# Altium project wius_hardware.PrjPcb
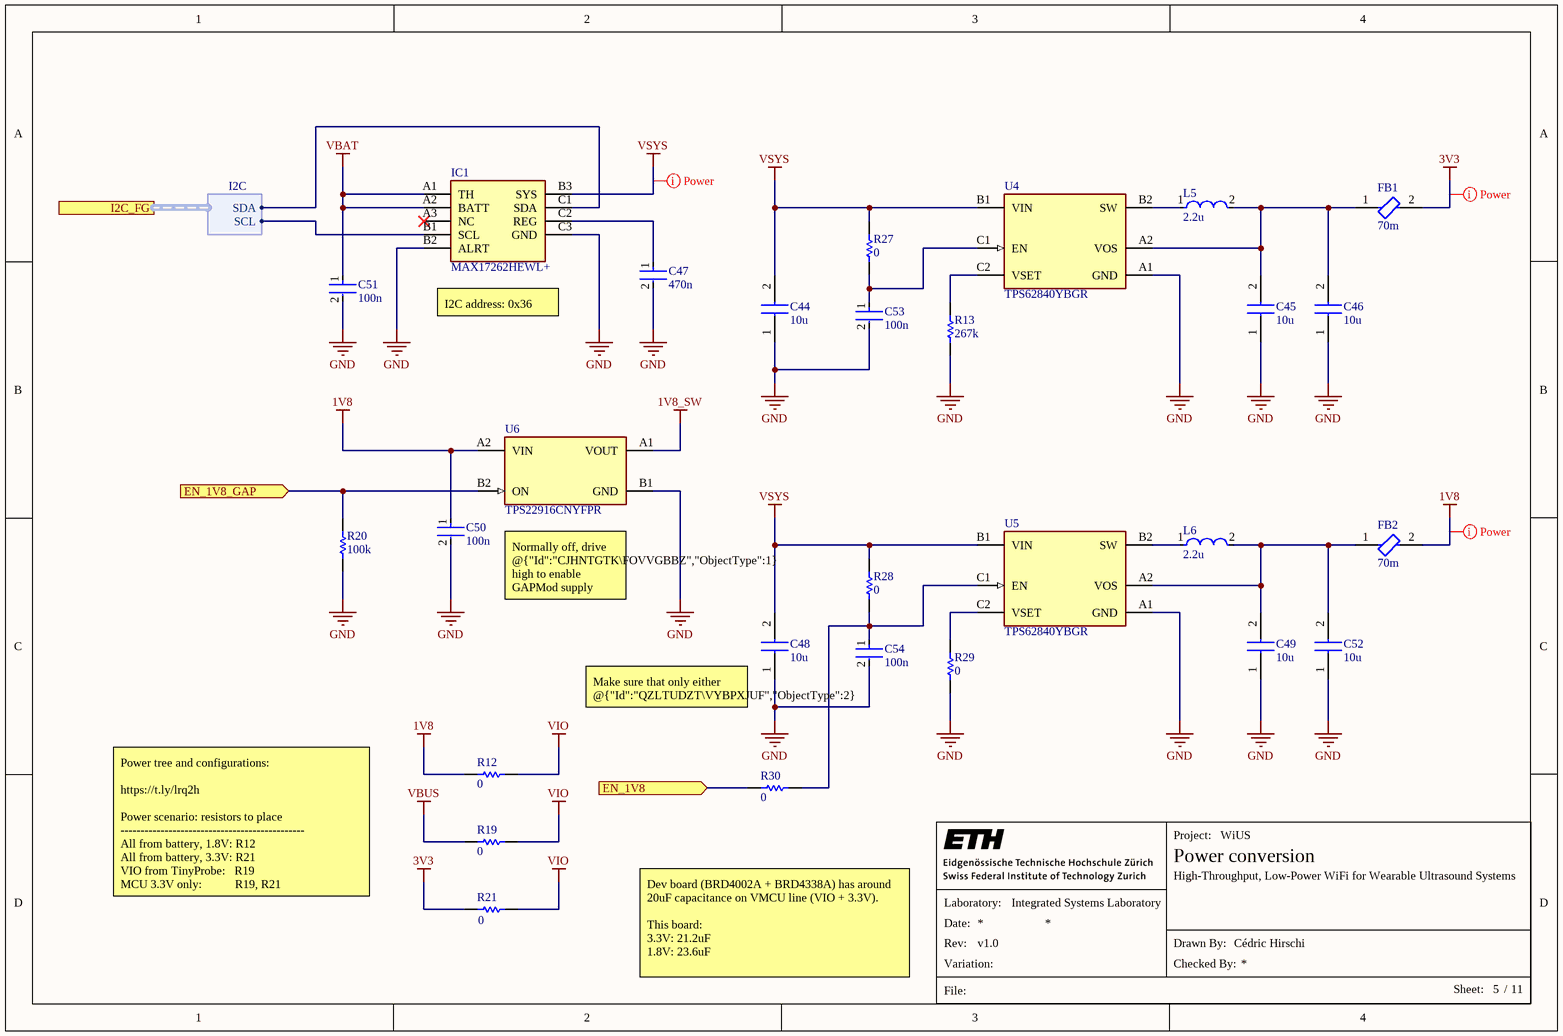
[diagram p0: power_conversion.SchDoc]
Desc1: High-Throughput, Low-Power WiFi for Wearable Ultrasound Systems; DrawnBy: Cédric Hirschi; FileInfo: =DocumentName; Organization: Integrated Systems Laboratory; ProjectTitle: WiUS; Revision: v1.0
5 sheets, 66 parts. Net scope: hierarchical (ports join the sheet entries above them; power ports are global).
Board file: wius.PcbDoc
Sheets:
  power_conversion.SchDoc
  power_io.SchDoc
    Core power conversion = power_core.SchDoc
    I/O bank B = io_b.SchDoc
  rf_clocks.SchDoc

## Sheet power_conversion.SchDoc: Power conversion
size A4; SheetNumber: 5; SheetTotal: 11

### Parts
C44  10u  [CAPC1608X100N]
C45  10u  [CAPC1608X100N]
C46  10u  [CAPC1608X100N]
C47  470n  [FP-GRM15-0_1-MFG]
C48  10u  [CAPC1608X100N]
C49  10u  [CAPC1608X100N]
C50  100n  [FP-GRT155-0_05-MFG]
C51  100n  [FP-GRT155-0_05-MFG]
C52  10u  [CAPC1608X100N]
C53  100n  [FP-GRT155-0_05-MFG]
C54  100n  [FP-GRT155-0_05-MFG]
FB1  70m  [FP-BLM15-0_05-MFG]
FB2  70m  [FP-BLM15-0_05-MFG]
IC1  MAX17262HEWL+  [BGA9C40P3X3_153X153X69]
L5  2.2u  [FP-DFE201612C-MFG]
L6  2.2u  [FP-DFE201612C-MFG]
R12  value 0  [RESC1005X40X25ML05T10]  (hidden comment: Resistor 0R 0402 63 mW)
R13  267k  [RESC1005X40X25LL05T10]
R19  value 0  [RESC1005X40X25ML05T10]  (hidden comment: Resistor 0R 0402 63 mW)
R20  100k  [RESC1005X40X25NL05T10]
R21  value 0  [RESC1005X40X25ML05T10]  (hidden comment: Resistor 0R 0402 63 mW)
R27  value 0  [RESC1005X40X25ML05T10]  (hidden comment: Resistor 0R 0402 63 mW)
R28  value 0  [RESC1005X40X25ML05T10]  (hidden comment: Resistor 0R 0402 63 mW)
R29  value 0  [RESC1005X40X25ML05T10]  (hidden comment: Resistor 0R 0402 63 mW)
R30  value 0  [RESC1005X40X25ML05T10]  (hidden comment: Resistor 0R 0402 63 mW)
U4  TPS62840YBGR  [FP-YBG0006-MFG]
U5  TPS62840YBGR  [FP-YBG0006-MFG]
U6  TPS22916CNYFPR  [FP-YFP0004-IPC_C]

### Ports
EN_1V8 (in, see main[4C], io_a[3B], power_io[6B]), EN_1V8_GAP (in, see main[4C], io_a[3B], power_io[6B]), I2C_FG (harness I2C, see main[4C], connectors[2B], io_b[4B], power_io[6C])

### Harnesses
I2C: SDA, SCL

### Nets
1V8: C50.1 FB2.2 R12.2 U6.A2(VIN)
1V8_SW: U6.A1(VOUT)
3V3: FB1.2 R21.1
GND: C44.1 C45.1 C46.1 C47.2 C48.1 C49.1 C50.2 C51.2 C52.1 C53.2 C54.2 IC1.B2(ALRT) IC1.C3(GND) R13.1 R20.1 R29.2 U4.A1(GND) U5.A1(GND) U6.B1(GND)
VBAT: C51.1 IC1.A1(TH) IC1.A2(BATT)
VBUS: R19.2
VIO: R12.1 R19.1 R21.2
VSYS: C44.2 C48.2 IC1.B3(SYS) R27.1 R28.1 U4.B1(VIN) U5.B1(VIN)
NetC45_2: C45.2 C46.2 FB1.1 L5.2 U4.A2(VOS)
NetC47_1: C47.1 IC1.C2(REG)
NetC49_2: C49.2 C52.2 FB2.1 L6.2 U5.A2(VOS)
NetC53_1: C53.1 R27.2 U4.C1(EN)
NetC54_1: C54.1 R28.2 R30.2 U5.C1(EN)
NetIC1_B1: IC1.B1(SCL) ; port I2C_FG.SCL
NetIC1_C1: IC1.C1(SDA) ; port I2C_FG.SDA
NetL5_1: L5.1 U4.B2(SW)
NetL6_1: L6.1 U5.B2(SW)
NetR13_2: R13.2 U4.C2(VSET)
NetR20_2: R20.2 U6.B2(ON) ; port EN_1V8_GAP
NetR29_1: R29.1 U5.C2(VSET)
NetR30_1: R30.1 ; port EN_1V8

Not connected (* = marked no-connect by the designer): IC1 A3(NC)*

### Layout directives
net class Power: 1V8, 3V3, VSYS

### Notes on the sheet
- (near IC1) I2C address: 0x36
- Normally off, drive @{"Id":"CJHNTGTK\FOVVGBBZ","ObjectType":1} high to enable GAPMod supply
- (near C48) Make sure that only either @{"Id":"QZLTUDZT\VYBPXJUF","ObjectType":2} or @{"Id":"QZLTUDZT\XKOCDFZE","ObjectType":2} is mounted
- Power tree and configurations:
  https://t.ly/lrq2h
  Power scenario: resistors to place
  ----------------------------------------------
  All from battery, 1.8V: R12
  All from battery, 3.3V: R21
  VIO from TinyProbe:   R19
  MCU 3.3V only:           R19, R21
- Dev board (BRD4002A + BRD4338A) has around 20uF capacitance on VMCU line (VIO + 3.3V).
  This board:
  3.3V: 21.2uF
  1.8V: 23.6uF
- Project:
- Laboratory:
- Date:
- File:
- Rev:
- Variation:
- Drawn By:
- Checked By:
- Sheet:
- /

### Library data of the parts
C44-C46 C48 C49 C52 = GMC10X7R106K10NT: Cap Cer 10UF 10V X7R 0603; Manufacturer_Name: Cal-Chip; Datasheet Link: https://88ce57.p3cdn1.secureserver.net/wp-content/uploads/2023/01/gmc_series-2.pdf; Height: 1mm; Manufacturer_Part_Number: GMC10X7R106K10NT; Supplier 1: Digikey; Supplier Part Number 1: 4713-GMC10X7R106K10NTCT-ND
C47 = CMP-2000-05009-2: CAP CER 0.47UF 10V X5R 0402; Manufacturer: Murata Electronics North America; Manufacturer Part Number: GRM155R61A474KE15D; Temperature Coefficient: 15%; Material: Ceramic; Tolerance: 10%; Device Class L3: Ceramic Capacitors; ComponentLink2Description: Datasheet; ComponentLink2URL: https://search.murata.co.jp/Ceramy/image/img/A01X/G101/ENG/GRM155R61A474KE15-01A.pdf; Package: GRM15-0.1; Voltage Rating: 10V; Capacitance: 0.47uF; Category: Cap; Temperature Range High: +85°C; Temperature Range Low: -55°C; Height: 0.55mm; Device Class L2: Capacitors; Lead Free: Yes; Mouser Description: Multilayer Ceramic Capacitors MLCC - SMD/SMT 0402 0.47uF 10volts X5R 10%; Ipc Land Pattern Name: CAPC10050X50; Temperature Characteristic: X5R; Digikey Description: CAP CER 0.47UF 10V X5R 0402; Value: 0.47uF; Octopart: https://octopart.com/grm155r61a474ke15d-murata-196883; Automotive: No; Device Class L1: Passive Components; Temperature: -55°C to +85°C; RoHS: TRUE
C50 C51 C53 C54 = CMP-06035-014200-1: Multi-Layer Ceramic Capacitor 100nF 50V X7R ±10% 0402 Paper T/R
FB1 FB2 = CMP-0686-00284-4: Chip Ferrite Bead, 0402, 80Ω @ 100MHz, 0.07Ω, 25%, 1.5A; Number of Lines: 1; DC Resistance-Max: 70mR; Impedance: 80R; Height: 0.5mm; Package Quantity: 1; RoHS Compliant: Yes; Max Operating Temperature: 125°C; Depth: 0.5mm; Max Current Rating: 1.5A; Max DC Current: 1.5A; Current Rating: 1.5A; Number of Pins: 2; Case Code (Imperial): 0402; Case/Package: 0402; Case Code (Metric): 1005; Material: Ferrite; Packaging: Tape and Reel; REACH SVHC: No SVHC; Length: 1mm; Tolerance: 25%; Termination: SMD/SMT; Series: BLM15PD; Number of Circuits: 1; Test Frequency: 100MHz; DC Resistance (DCR): 70mR; Min Operating Temperature: -55°C; Lead Free: Lead Free; Width: 0.5mm
IC1 = MAX17262HEWL+: Integrated Circuit; Manufacturer_Name: Analog Devices; Datasheet Link: https://www.analog.com/MAX17262/datasheet; Height: 0.69mm; Manufacturer_Part_Number: MAX17262HEWL+
L5 L6 = CMP-06042-009962-1: Shielded Wirewound Inductor 2.2uH 20% 1800mA 0.116Ω 0806 (2016)
R12 R19 R21 R27-R30 = CMP-009-00004-5: Chip Resistor, 0 Ohm, 0.063 W, -55 to 155 degC, 0402 (1005 Metric); Power: 63mW; Voltage Rating: 50V; Max Operating Temperature: 155°C; Pins: 2; RoHS Compliant: True; Min Operating Temperature: -55°C; Mounting Technology: SM; Case/Package: 0402
R13 = CMP-2002-07544-1: Manufacturer: Yageo; Part Number: RC0402FR-07267KL
R20 = CMP-2002-07343-1: Part Number: RC0402FR-07100KL; Manufacturer: Yageo / Phycomp
U4 U5 = CMP-04918-000401-1: ULTRA LOW IQ BUCK CONVERTER
U6 = CMP-04910-000105-1: IC PWR SWITCH P-CHAN 1:1 4DSBGA; Max Output Current: 2A; Number of Outputs: 1; Fault Protection: Reverse Current; Output Configuration: High Side; RoHS Compliant: Yes; Min Operating Temperature: -40°C; Packaging: Cut Tape; Number of Channels: 1; Max Operating Temperature: 85°C

## Sheet power_io.SchDoc: Power & I/O
size A3; SheetNumber: 6; SheetTotal: 11
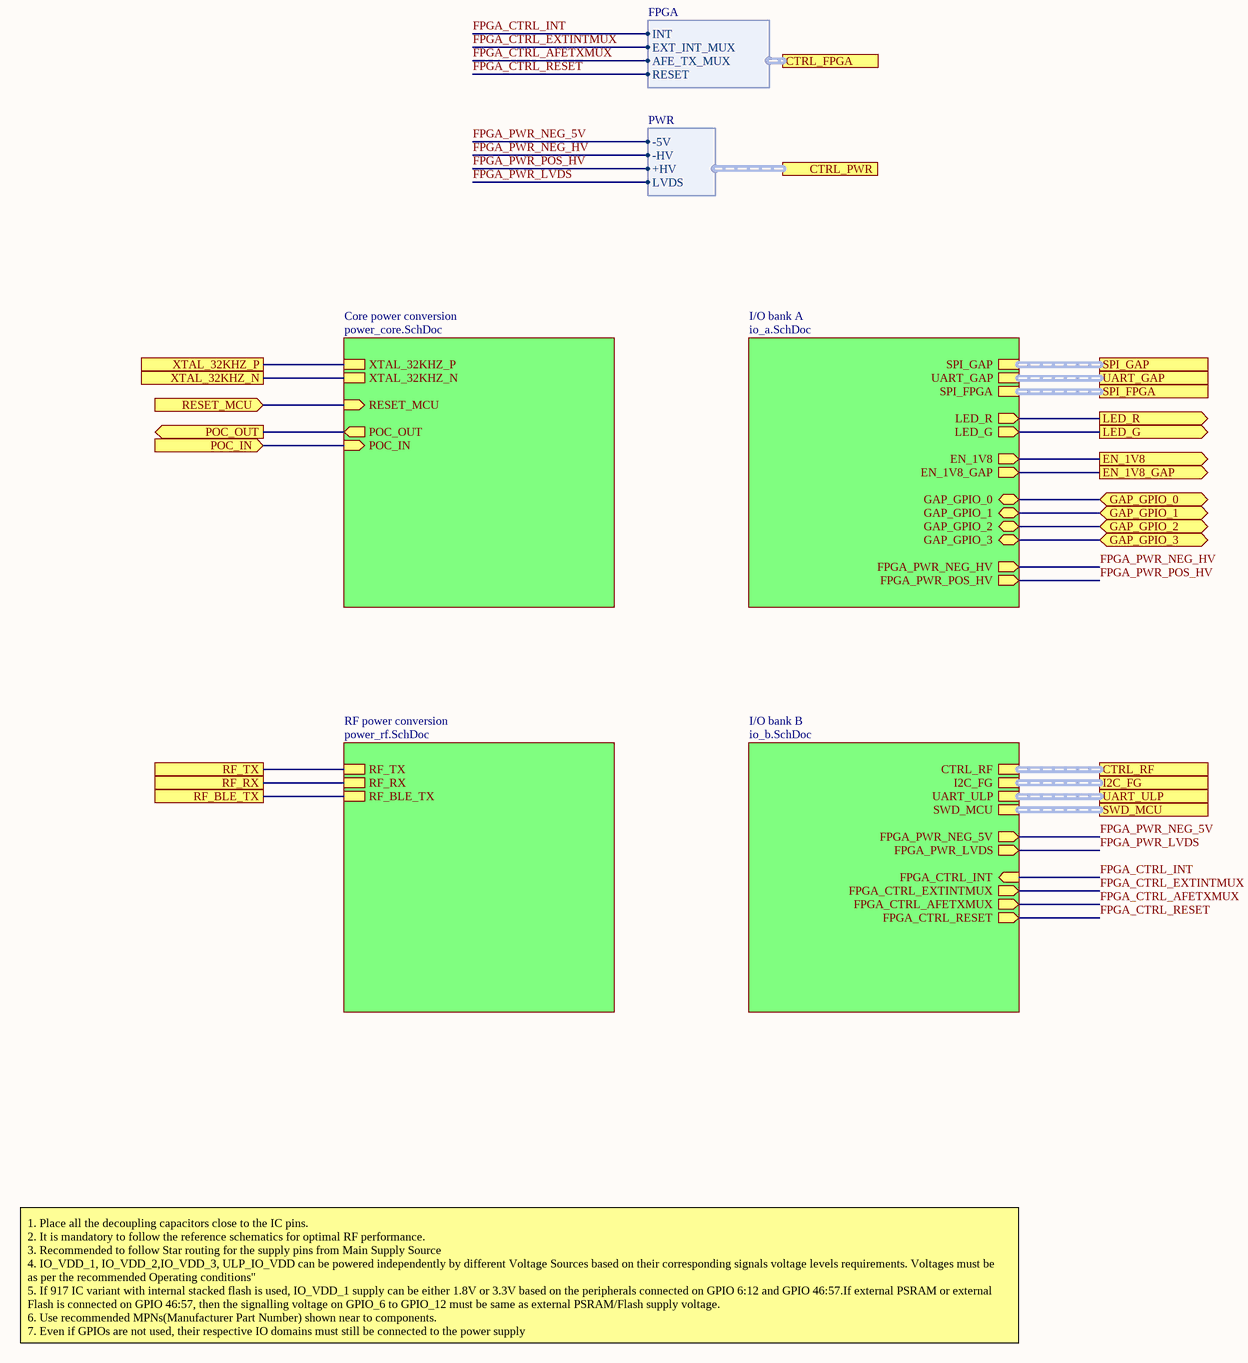
[diagram p1: power_io.SchDoc]

### Sub-sheets
Core power conversion = power_core.SchDoc: XTAL_32KHZ_P, XTAL_32KHZ_N, RESET_MCU (in), POC_OUT (out), POC_IN (in)
I/O bank A = io_a.SchDoc (file not in this document): SPI_GAP (harness SPI), UART_GAP (harness UART), SPI_FPGA (harness SPI), LED_R (out), LED_G (out), EN_1V8 (out), GAP_GPIO_0 (bidir), GAP_GPIO_1 (bidir), GAP_GPIO_2 (bidir), GAP_GPIO_3 (bidir), FPGA_PWR_NEG_HV (out), FPGA_PWR_POS_HV (out), EN_1V8_GAP (out)
I/O bank B = io_b.SchDoc: CTRL_RF (harness RF), I2C_FG (harness I2C), UART_ULP (harness UART), SWD_MCU (harness SWD), FPGA_CTRL_INT (in), FPGA_CTRL_EXTINTMUX (out), FPGA_CTRL_AFETXMUX (out), FPGA_CTRL_RESET (out), FPGA_PWR_NEG_5V (out), FPGA_PWR_LVDS (out)
RF power conversion = power_rf.SchDoc (file not in this document): RF_TX, RF_RX, RF_BLE_TX

### Ports
CTRL_FPGA (harness FPGA, see main[4B], connectors[4C]), CTRL_PWR (harness PWR, see main[4B], connectors[2C]), CTRL_RF (harness RF, see main[5A], io_b[4B], rf_clocks[1C]), EN_1V8 (out, see main[4C], io_a[3B], power_conversion[1B]), EN_1V8_GAP (out, see main[4C], io_a[3B]), GAP_GPIO_0 (bidir, see main[5B], gap[3C], io_a[3B]), GAP_GPIO_1 (bidir, see main[5B], gap[3C], io_a[3B]), GAP_GPIO_2 (bidir, see main[5B], gap[3C], io_a[3B]), GAP_GPIO_3 (bidir, see main[5B], gap[3C], io_a[3B]), I2C_FG (harness I2C, see main[4B], connectors[2B], io_b[4B], power_conversion[1A]), LED_G (out, see main[4B], debug_interface[1D], io_a[3A]), LED_R (out, see main[4A], debug_interface[1D], io_a[3A]), POC_IN (in, see main[4A], debug_interface[3B], power_core[1C]), POC_OUT (out, see main[4A], debug_interface[3A], power_core[1C]), RESET_MCU (in, see main[4A], debug_interface[1C], power_core[1C]), RF_BLE_TX (see main[5A], power_rf[4C], rf_clocks[4A]), RF_RX (see main[5A], power_rf[4B], rf_clocks[4B]), RF_TX (see main[5A], power_rf[4A], rf_clocks[4B]), SPI_FPGA (harness SPI, see main[4B], connectors[4B], io_a[3C]), SPI_GAP (harness SPI, see main[5B], gap[3C], io_a[3B]), SWD_MCU (harness SWD, see main[4A], debug_interface[3B], io_b[4C]), UART_GAP (harness UART, see main[5B], gap[1C], io_a[3B]), UART_ULP (harness UART, see main[4A], debug_interface[3B], io_b[4C]), XTAL_32KHZ_N (see main[5A], power_core[1C], rf_clocks[2B]), XTAL_32KHZ_P (see main[5A], power_core[1C], rf_clocks[1B])

### Harnesses
PWR: -5V, -HV, +HV, LVDS
FPGA: INT, EXT_INT_MUX, AFE_TX_MUX, RESET

### Nets
FPGA_CTRL_AFETXMUX: sheet I/O bank B/FPGA_CTRL_AFETXMUX, port CTRL_FPGA.AFE_TX_MUX
FPGA_CTRL_EXTINTMUX: sheet I/O bank B/FPGA_CTRL_EXTINTMUX, port CTRL_FPGA.EXT_INT_MUX
FPGA_CTRL_INT: sheet I/O bank B/FPGA_CTRL_INT, port CTRL_FPGA.INT
FPGA_CTRL_RESET: sheet I/O bank B/FPGA_CTRL_RESET, port CTRL_FPGA.RESET
FPGA_PWR_LVDS: sheet I/O bank B/FPGA_PWR_LVDS, port CTRL_PWR.LVDS
FPGA_PWR_NEG_5V: sheet I/O bank B/FPGA_PWR_NEG_5V, port CTRL_PWR.-5V
FPGA_PWR_NEG_HV: sheet I/O bank A/FPGA_PWR_NEG_HV, port CTRL_PWR.-HV
FPGA_PWR_POS_HV: sheet I/O bank A/FPGA_PWR_POS_HV, port CTRL_PWR.+HV
POC_IN: port POC_IN, sheet Core power conversion/POC_IN
POC_OUT: port POC_OUT, sheet Core power conversion/POC_OUT
RESET_MCU: port RESET_MCU, sheet Core power conversion/RESET_MCU
NetU2_A29: port XTAL_32KHZ_P, sheet Core power conversion/XTAL_32KHZ_P
NetU2_B26: port XTAL_32KHZ_N, sheet Core power conversion/XTAL_32KHZ_N
(unnamed): port RF_TX, sheet RF power conversion/RF_TX
(unnamed): port RF_RX, sheet RF power conversion/RF_RX
(unnamed): port RF_BLE_TX, sheet RF power conversion/RF_BLE_TX
(unnamed): port LED_R, sheet I/O bank A/LED_R
(unnamed): port LED_G, sheet I/O bank A/LED_G
(unnamed): port EN_1V8, sheet I/O bank A/EN_1V8
(unnamed): port GAP_GPIO_0, sheet I/O bank A/GAP_GPIO_0
(unnamed): port GAP_GPIO_1, sheet I/O bank A/GAP_GPIO_1
(unnamed): port GAP_GPIO_2, sheet I/O bank A/GAP_GPIO_2
(unnamed): port GAP_GPIO_3, sheet I/O bank A/GAP_GPIO_3
(unnamed): port EN_1V8_GAP, sheet I/O bank A/EN_1V8_GAP

### Buses and harness runs
harness port CTRL_RF = sheet I/O bank B/CTRL_RF
harness port I2C_FG = sheet I/O bank B/I2C_FG
harness port SPI_FPGA = sheet I/O bank A/SPI_FPGA
harness port SPI_GAP = sheet I/O bank A/SPI_GAP
harness port SWD_MCU = sheet I/O bank B/SWD_MCU
harness port UART_GAP = sheet I/O bank A/UART_GAP
harness port UART_ULP = sheet I/O bank B/UART_ULP

### Notes on the sheet
- 1. Place all the decoupling capacitors close to the IC pins.
  2. It is mandatory to follow the reference schematics for optimal RF performance.
  3. Recommended to follow Star routing for the supply pins from Main Supply Source
  4. IO_VDD_1, IO_VDD_2,IO_VDD_3, ULP_IO_VDD can be powered independently by different Voltage Sources based on their corresponding signals voltage levels requirements. Voltages must be
  as per the recommended Operating conditions"
  5. If 917 IC variant with internal stacked flash is used, IO_VDD_1 supply can be either 1.8V or 3.3V based on the peripherals connected on GPIO 6:12 and GPIO 46:57.If external PSRAM or external
  Flash is connected on GPIO 46:57, then the signalling voltage on GPIO_6 to GPIO_12 must be same as external PSRAM/Flash supply voltage.
  6. Use recommended MPNs(Manufacturer Part Number) shown near to components.
  7. Even if GPIOs are not used, their respective IO domains must still be connected to the power supply
- Project:
- Laboratory:
- Date:
- File:
- Rev:
- Variation:
- Drawn By:
- Checked By:
- Sheet:
- /

## Sheet power_core.SchDoc: Core power conversion
size A4; SheetNumber: 7; SheetTotal: 11
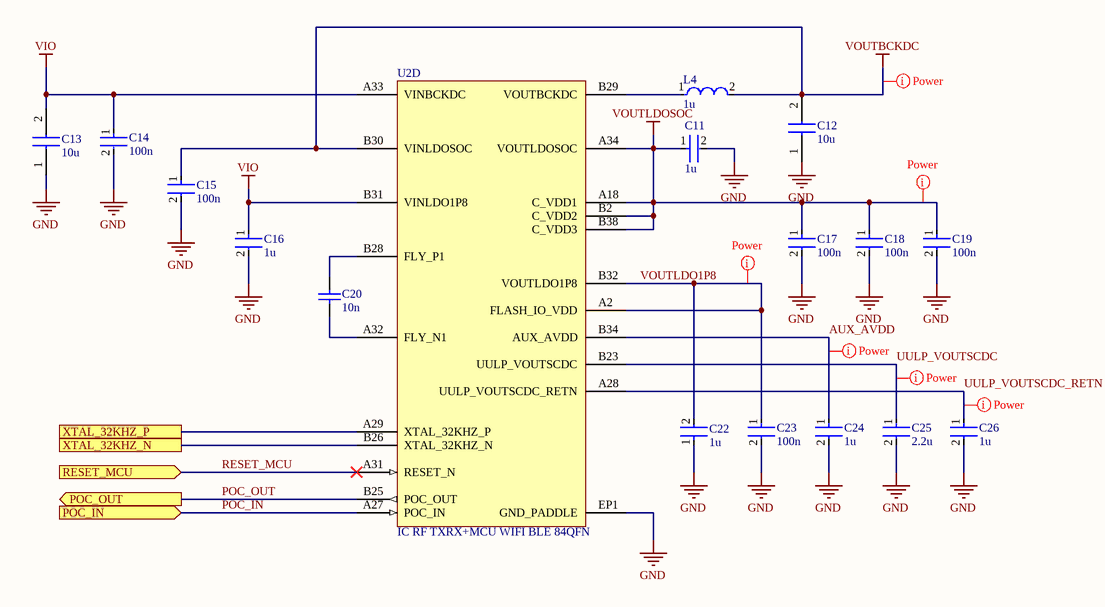
[diagram p2: power_core.SchDoc]

### Parts
C11  1u  [FP-GRM155-0_05-MFG]
C12  10u  [CAPC1608X100N]
C13  10u  [CAPC1608X100N]
C14  100n  [FP-GRT155-0_05-MFG]
C15  100n  [FP-GRT155-0_05-MFG]
C16  1u  [FP-GRM155-0_05-MFG]
C17  100n  [FP-GRT155-0_05-MFG]
C18  100n  [FP-GRT155-0_05-MFG]
C19  100n  [FP-GRT155-0_05-MFG]
C20  10n  [CAPC1005X55X25LL05T10]
C22  1u  [FP-GRM155-0_05-MFG]
C23  100n  [FP-GRT155-0_05-MFG]
C24  1u  [FP-GRM155-0_05-MFG]
C25  2.2u  [FP-GRM155-0_2-IPC_C]
C26  1u  [FP-GRM155-0_05-MFG]
L4  1u  [FP-DFE201210U-IPC_C]
U2  IC RF TXRX+MCU WIFI BLE 84QFN  [SIWG917M110LGTBA]  (part D of 4)

### Ports
POC_IN (in, see power_io[3B], debug_interface[3B], power_io[2B]), POC_OUT (out, see power_io[3B], debug_interface[3A], power_io[2B]), RESET_MCU (in, see power_io[3B], debug_interface[1C], power_io[2B]), XTAL_32KHZ_N (see power_io[3B], power_io[2B], rf_clocks[2B]), XTAL_32KHZ_P (see power_io[3B], power_io[2B], rf_clocks[1B])

### Nets
GND: C11.2 C12.1 C13.1 C14.2 C15.2 C16.2 C17.2 C18.2 C19.2 C22.1 C23.2 C24.2 C25.2 C26.2 U2.EP1(GND_PADDLE)
VIO: C13.2 C14.1 C16.1 U2.A33(VINBCKDC) U2.B31(VINLDO1P8)
VOUTBCKDC: C12.2 C15.1 L4.2 U2.B30(VINLDOSOC)
VOUTLDOSOC: C11.1 C17.1 C18.1 C19.1 U2.A18(C_VDD1) U2.A34(VOUTLDOSOC) U2.B2(C_VDD2) U2.B38(C_VDD3)
AUX_AVDD: C24.1 U2.B34(AUX_AVDD)
POC_IN: U2.A27(POC_IN) ; port POC_IN
POC_OUT: U2.B25(POC_OUT) ; port POC_OUT
RESET_MCU: U2.A31(RESET_N) ; port RESET_MCU
UULP_VOUTSCDC: C25.1 U2.B23(UULP_VOUTSCDC)
UULP_VOUTSCDC_RETN: C26.1 U2.A28(UULP_VOUTSCDC_RETN)
VOUTLDO1P8: C22.2 C23.1 U2.A2(FLASH_IO_VDD) U2.B32(VOUTLDO1P8)
NetC20_1: C20.1 U2.B28(FLY_P1)
NetC20_2: C20.2 U2.A32(FLY_N1)
NetL4_1: L4.1 U2.B29(VOUTBCKDC)
NetU2_A29: U2.A29(XTAL_32KHZ_P) ; port XTAL_32KHZ_P
NetU2_B26: U2.B26(XTAL_32KHZ_N) ; port XTAL_32KHZ_N

### Layout directives
net class Power: AUX_AVDD, UULP_VOUTSCDC, UULP_VOUTSCDC_RETN, VOUTBCKDC, VOUTLDO1P8, VOUTLDOSOC

### Notes on the sheet
- Project:
- Laboratory:
- Date:
- File:
- Rev:
- Variation:
- Drawn By:
- Checked By:
- Sheet:
- /

### Library data of the parts
C11 C16 C22 C24 C26 = CMP-06035-025126-1: Chip Multilayer Ceramic Capacitors for General Purpose, 0402, 1.0uF, X6S, 22%, 10%, 16V; Capacitance: 1uF; Thickness: 500um; Voltage Rating (DC): 16V; Tolerance: 10%; Width: 500um; Length: 1mm; Dielectric: X6S
C12 C13 = GMC10X7R106K10NT: as C44 on sheet power_conversion; Datasheet Link: https://88ce57.p3cdn1.secureserver.net/wp-content/uploads/2023/01/gmc_series-2.pdf; Height: 1mm; Manufacturer_Part_Number: GMC10X7R106K10NT; Supplier 1: Digikey; Supplier Part Number 1: 4713-GMC10X7R106K10NTCT-ND
C14 C15 C17-C19 C23 = CMP-06035-014200-1: as C50 on sheet power_conversion
C20 = CMP-1034-01880-2: Manufacturer: Murata; Part Number: GRM155R71E103KA01D
C25 = CMP-06035-000377-1: Chip Multilayer Ceramic Capacitors for General Purpose, 0402, 2.2uF, X7S, 22%, 10%, 10V; Thickness: 0.022inch; Height: 0.5mm; Packaging: Tape and Reel; Voltage Rating (DC): 10V; Tolerance: 10%; Capacitance: 2.2uF; Case Code (Metric): 1005; Voltage Rating: 10V; Termination: SMD/SMT; Weight: 0.000212oz; Min Operating Temperature: -55°C; Max Operating Temperature: 125°C; Case/Package: 0402; Length: 0.039inch; Dielectric: X7S; Resistor Type: Ceramic; Width: 0.5mm; Mount: Surface Mount; Package Quantity: 10000; Case Code (Imperial): 0402; Lead Free: Lead Free
L4 = CMP-06042-016601-1: FIXED IND 1.0UH 2.0A 95MOHM; RoHS Compliant: Yes
U2 = SIWG917

## Sheet io_b.SchDoc: I/O bank B
size A4; SheetNumber: 10; SheetTotal: 11
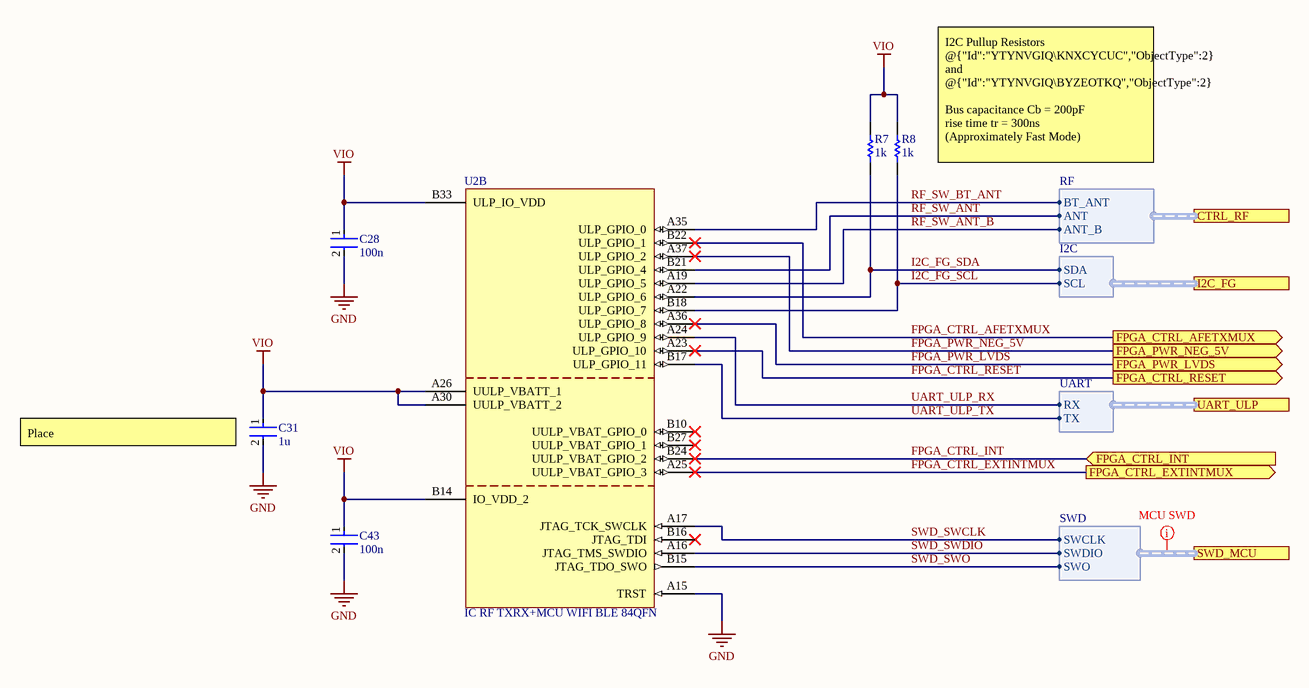
[diagram p3: io_b.SchDoc]

### Parts
C28  100n  [FP-GRT155-0_05-MFG]
C31  1u  [FP-GRM155-0_05-MFG]
C43  100n  [FP-GRT155-0_05-MFG]
R7  1k  [RESC1005X40X25LL05T10]
R8  1k  [RESC1005X40X25LL05T10]
U2  IC RF TXRX+MCU WIFI BLE 84QFN  [SIWG917M110LGTBA]  (part B of 4)

### Ports
CTRL_RF (harness RF, see power_io[6C], rf_clocks[1C]), FPGA_CTRL_AFETXMUX (out, see power_io[6C]), FPGA_CTRL_EXTINTMUX (out, see power_io[6C]), FPGA_CTRL_INT (in, see power_io[6C]), FPGA_CTRL_RESET (out, see power_io[6C]), FPGA_PWR_LVDS (out, see power_io[6C]), FPGA_PWR_NEG_5V (out, see power_io[6C]), I2C_FG (harness I2C, see power_io[6C], connectors[2B], power_conversion[1A], power_io[6C]), SWD_MCU (harness SWD, see power_io[6C], debug_interface[3B], power_io[6C]), UART_ULP (harness UART, see power_io[6C], debug_interface[3B], power_io[6C])

### Harnesses
I2C: SDA, SCL
RF: BT_ANT, ANT, ANT_B
UART: RX, TX
SWD: SWCLK, SWDIO, SWO

### Nets
GND: C28.2 C31.2 C43.2 U2.A15(TRST)
VIO: C28.1 C31.1 C43.1 R7.2 R8.2 U2.A26(UULP_VBATT_1) U2.A30(UULP_VBATT_2) U2.B14(IO_VDD_2) U2.B33(ULP_IO_VDD)
FPGA_CTRL_AFETXMUX: U2.B22(ULP_GPIO_1) ; port FPGA_CTRL_AFETXMUX
FPGA_CTRL_EXTINTMUX: U2.A25(UULP_VBAT_GPIO_3) ; port FPGA_CTRL_EXTINTMUX
FPGA_CTRL_INT: U2.B24(UULP_VBAT_GPIO_2) ; port FPGA_CTRL_INT
FPGA_CTRL_RESET: U2.A23(ULP_GPIO_10) ; port FPGA_CTRL_RESET
FPGA_PWR_LVDS: U2.A36(ULP_GPIO_8) ; port FPGA_PWR_LVDS
FPGA_PWR_NEG_5V: U2.A37(ULP_GPIO_2) ; port FPGA_PWR_NEG_5V
I2C_FG_SCL: R8.1 U2.B18(ULP_GPIO_7) ; port I2C_FG.SCL
I2C_FG_SDA: R7.1 U2.A22(ULP_GPIO_6) ; port I2C_FG.SDA
RF_SW_ANT: U2.B21(ULP_GPIO_4) ; port CTRL_RF.ANT
RF_SW_ANT_B: U2.A19(ULP_GPIO_5) ; port CTRL_RF.ANT_B
RF_SW_BT_ANT: U2.A35(ULP_GPIO_0) ; port CTRL_RF.BT_ANT
SWD_SWCLK: U2.A17(JTAG_TCK_SWCLK) ; port SWD_MCU.SWCLK
SWD_SWDIO: U2.A16(JTAG_TMS_SWDIO) ; port SWD_MCU.SWDIO
SWD_SWO: U2.B15(JTAG_TDO_SWO) ; port SWD_MCU.SWO
UART_ULP_RX: U2.A24(ULP_GPIO_9) ; port UART_ULP.RX
UART_ULP_TX: U2.B17(ULP_GPIO_11) ; port UART_ULP.TX

Not connected (* = marked no-connect by the designer): U2 B10(UULP_VBAT_GPIO_0)* B16(JTAG_TDI)* B27(UULP_VBAT_GPIO_1)*

### Layout directives
net class SWD_MCU: (no net found under the mark)

### Notes on the sheet
- (near R8) I2C Pullup Resistors @{"Id":"YTYNVGIQ\KNXCYCUC","ObjectType":2} and @{"Id":"YTYNVGIQ\BYZEOTKQ","ObjectType":2}
  Bus capacitance Cb = 200pF
  rise time tr = 300ns
  (Approximately Fast Mode)
  Pullup resistance Rp
  min = 720Ohm
  max = 1770Ohm
- (near C31) Place @{"Id":"YTYNVGIQ\TQWKBKJS","ObjectType":2} close to UULP_VBATT_2
- Project:
- Laboratory:
- Date:
- File:
- Rev:
- Variation:
- Drawn By:
- Checked By:
- Sheet:
- /

### Library data of the parts
C28 C43 = CMP-06035-014200-1: as C50 on sheet power_conversion
C31 = CMP-06035-025126-1: as C11 on sheet power_core; Thickness: 500um; Voltage Rating (DC): 16V; Tolerance: 10%; Width: 500um; Length: 1mm; Dielectric: X6S
R7 R8 = CMP-2002-07865-1: Manufacturer: Yageo; Part Number: RC0402FR-131KL
U2 = SIWG917

## Sheet rf_clocks.SchDoc: RF & clocks
size A4; SheetNumber: 11; SheetTotal: 11
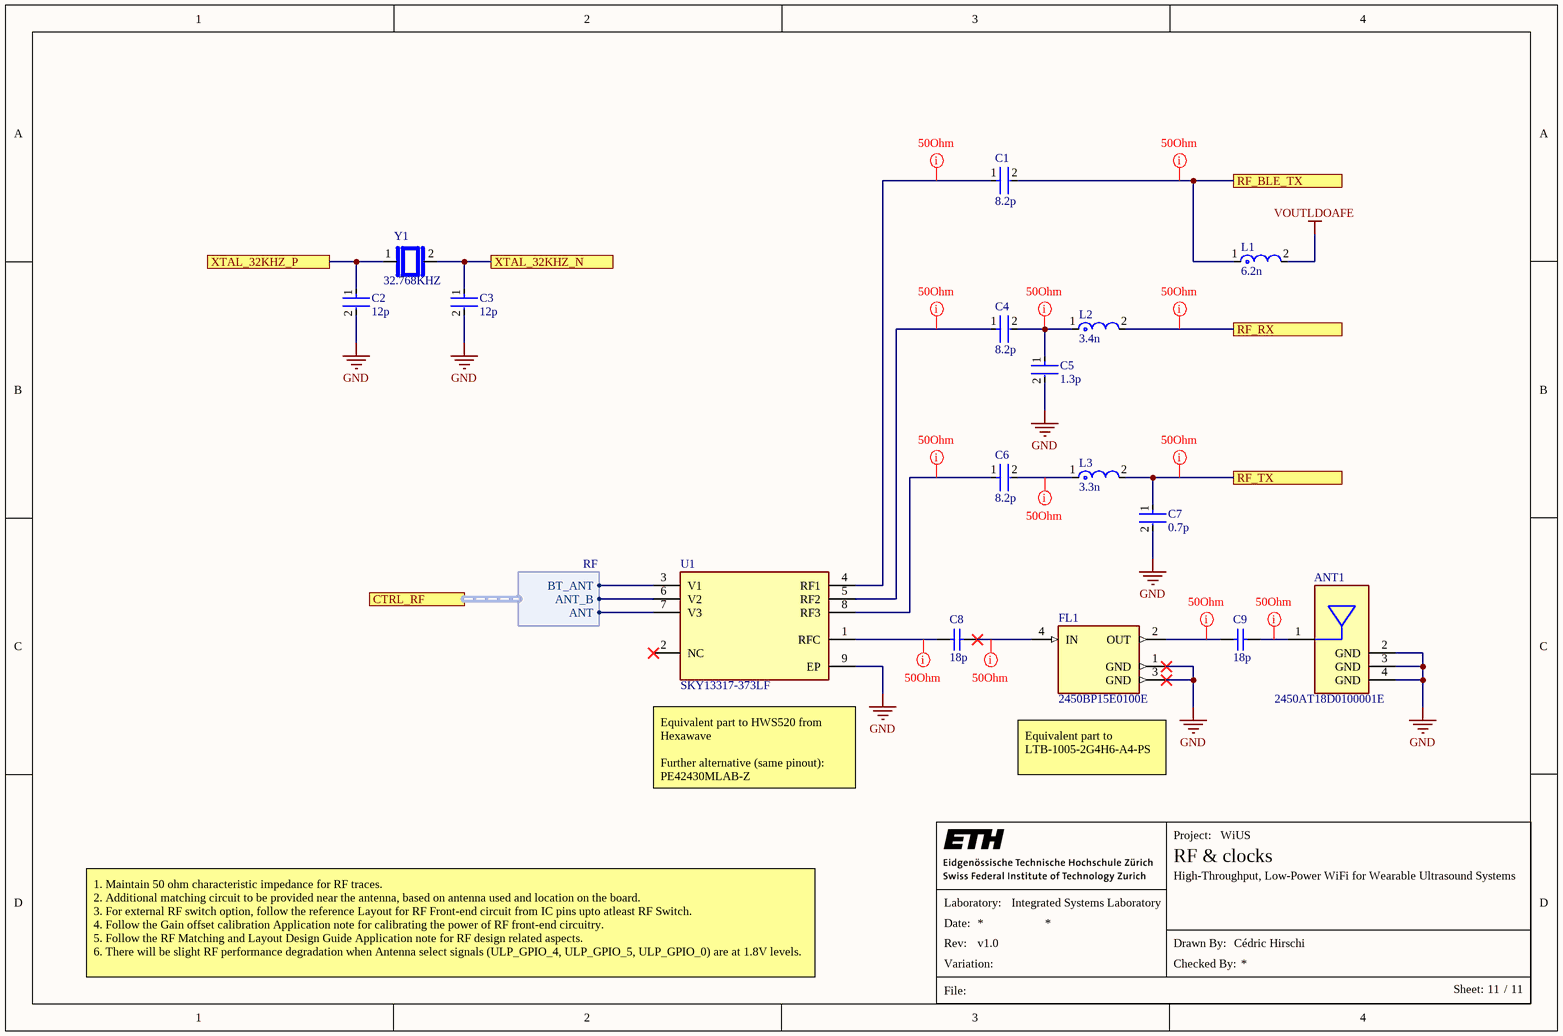
[diagram p4: rf_clocks.SchDoc]

### Parts
ANT1  2450AT18D0100001E  [FP-2450AT18D0100001E-MFG]
C1  8.2p  [FP-GJM155-0_05-IPC_B]
C2  12p  [FP-GRM155-0_05-MFG]
C3  12p  [FP-GRM155-0_05-MFG]
C4  8.2p  [FP-GJM155-0_05-IPC_B]
C5  1.3p  [FP-GJM155-0_05-IPC_B]
C6  8.2p  [FP-GJM155-0_05-IPC_B]
C7  0.7p  [FP-GJM155-0_05-IPC_C]
C8  18p  [CAPC1005X55X25LL05T10]
C9  18p  [CAPC1005X55X25LL05T10]
FL1  2450BP15E0100E  [FIL_2450BP15E0100E]
L1  6.2n  [FP-LQG15WH_02-IPC_C]
L2  3.4n  [FP-LQG15WH_02-IPC_C]
L3  3.3n  [FP-LQG15HH_02-IPC_C]
U1  SKY13317-373LF  [FP-SKY13317-373LF-MFG]
Y1  32.768KHZ  [XTAL_CM8V-T1A-32.768KHZ-7PF-20PPM-TA-QC]

### Ports
CTRL_RF (harness RF, see main[6A], io_b[4B], power_io[6C]), RF_BLE_TX (see main[6A], power_io[2C], power_rf[4C]), RF_RX (see main[6A], power_io[2C], power_rf[4B]), RF_TX (see main[6A], power_io[2C], power_rf[4A]), XTAL_32KHZ_N (see main[6A], power_core[1C], power_io[2B]), XTAL_32KHZ_P (see main[6A], power_core[1C], power_io[2B])

### Harnesses
RF: BT_ANT, ANT, ANT_B

### Nets
GND: ANT1.2(GND) ANT1.3(GND) ANT1.4(GND) C2.2 C3.2 C5.2 C7.2 FL1.1(GND) FL1.3(GND) U1.9(EP)
VOUTLDOAFE: L1.2
NetANT1_1: ANT1.1(FEED) C9.2
NetC1_1: C1.1 U1.4(RF1)
NetC1_2: C1.2 L1.1 ; port RF_BLE_TX
NetC2_1: C2.1 Y1.1 ; port XTAL_32KHZ_P
NetC3_1: C3.1 Y1.2 ; port XTAL_32KHZ_N
NetC4_1: C4.1 U1.5(RF2)
NetC4_2: C4.2 C5.1 L2.1
NetC6_1: C6.1 U1.8(RF3)
NetC6_2: C6.2 L3.1
NetC7_1: C7.1 L3.2 ; port RF_TX
NetC8_1: C8.1 U1.1(RFC)
NetC8_2: C8.2 FL1.4(IN)
NetC9_1: C9.1 FL1.2(OUT)
NetL2_2: L2.2 ; port RF_RX
NetU1_3: U1.3(V1) ; port CTRL_RF.BT_ANT
NetU1_6: U1.6(V2) ; port CTRL_RF.ANT_B
NetU1_7: U1.7(V3) ; port CTRL_RF.ANT

Not connected (* = marked no-connect by the designer): U1 2(NC)*

### Layout directives
rule Width Constraint [Pref Impedance = 50.00ohms    Min Impedance = 50.00ohms    Max Impedance = 50.00ohms]: NetANT1_1, NetC1_1, NetC1_2, NetC4_1, NetC4_2, NetC6_1, NetC6_2, NetC7_1, NetC8_1, NetC8_2, NetC9_1, NetL2_2

### Notes on the sheet
- (near U1) Equivalent part to HWS520 from Hexawave
  Further alternative (same pinout): PE42430MLAB-Z
- (near FL1) Equivalent part to LTB-1005-2G4H6-A4-PS
- 1. Maintain 50 ohm characteristic impedance for RF traces.
  2. Additional matching circuit to be provided near the antenna, based on antenna used and location on the board.
  3. For external RF switch option, follow the reference Layout for RF Front-end circuit from IC pins upto atleast RF Switch.
  4. Follow the Gain offset calibration Application note for calibrating the power of RF front-end circuitry.
  5. Follow the RF Matching and Layout Design Guide Application note for RF design related aspects.
  6. There will be slight RF performance degradation when Antenna select signals (ULP_GPIO_4, ULP_GPIO_5, ULP_GPIO_0) are at 1.8V levels.
- Project:
- Laboratory:
- Date:
- File:
- Rev:
- Variation:
- Drawn By:
- Checked By:
- Sheet:
- /

### Library data of the parts
ANT1 = CMP-00849-135603252-1: 2450AT18D0100001E 2.4 Ghz SMD Antenna Resiliant; Bandwidth: 100MHz; Impedance: 50Ω; Power Rating: 3W; Number of Bands: 1; Max Frequency: 2.5GHz; Return Loss: 10dB; Gain: -1dB; Min Operating Temperature: -40°C; Height: 1.3mm; Case/Package: 1206; NexarPartId: 135603252; Max Operating Temperature: 125°C
C1 C4 C6 = CMP-2008-03885-2: Multi-Layer Ceramic Capacitor 8.2pF C0G  ±0.1pF 0402 Paper T/R; Voltage Rating: 50V; Case Code (Imperial): 0402; Length: 1mm; Width: 0.02inch; Dielectric: C0G; Mount: Surface Mount; Case Code (Metric): 1005; Max Operating Temperature: 125°C; Thickness: 0.022inch; Lead Free: Lead Free; Package Quantity: 10000; Case/Package: 0402; Voltage Rating (DC): 50V; Termination: SMD/SMT; Height: 0.5mm; Capacitance: 8.2pF; Min Operating Temperature: -55°C; Radiation Hardening: No; Packaging: Tape and Reel; Depth: 0.5mm
C2 C3 = CMP-2008-03945-2: CAP CER 12PF 50V C0G/NP0 0402; Tolerance: 2%; Dielectric: C0G; Material: Ceramic; Termination: SMD/SMT; Mount: Surface Mount; REACH SVHC: No SVHC; Depth: 0.5mm; Case Code (Metric): 1005; Voltage Rating: 50V; Height: 0.5mm; Voltage Rating (DC): 50V; Case Code (Imperial): 0402; Package Quantity: 10000; Construction: Flat; Thickness: 0.022inch; Length: 1mm; Min Operating Temperature: -55°C; Width: 0.5mm; Lead Free: Lead Free; Capacitance: 12pF; Case/Package: 0402; Packaging: Tape and Reel; Series: GRM; Voltage: 50V; Radiation Hardening: No; Max Operating Temperature: 125°C
C5 = CMP-2008-03818-2: Multi-Layer Ceramic Capacitor 1.3pF C0G  ±0.05pF 0402 Paper T/R; Voltage Rating (DC): 50V; Radiation Hardening: No; Voltage Rating: 50V; Thickness: 0.022inch; Case Code (Metric): 1005; Packaging: Tape and Reel; Dielectric: C0G; Case Code (Imperial): 0402; Lead Free: Lead Free; Depth: 0.5mm; Termination: SMD/SMT; Case/Package: 0402; Min Operating Temperature: -55°C; Height: 0.5mm; Max Operating Temperature: 125°C; Capacitance: 1.3pF; Package Quantity: 10000; Width: 0.02inch; Length: 0.039inch; Mount: Surface Mount
C7 = CMP-2008-03909-2: Multi-Layer Ceramic Capacitor 0.7pF C0G  ±0.05pF 0402 Paper T/R; Voltage Rating (DC): 50V; Packaging: Tape and Reel; Case Code (Imperial): 0402; Mount: Surface Mount; Case Code (Metric): 1005; Width: 0.02inch; Length: 1mm; Radiation Hardening: No; Max Operating Temperature: 125°C; Termination: SMD/SMT; Dielectric: C0G; Min Operating Temperature: -55°C; Height: 0.5mm; Capacitance: 0.7pF; Voltage Rating: 50V; Thickness: 0.022inch; Package Quantity: 10000; Depth: 0.5mm; Case/Package: 0402
C8 C9 = CMP-2008-04271-1: Manufacturer: Murata; Part Number: GRM1555C1H180GA01D
FL1 = 2450BP15E0100E: Ceramic Filters Band Pass 1.5dB 50Ohm SMD 4Pin T/R; MF: {'manufacturer': u'Johanson Technology'}; Package: None; Price: None; Value: *; MP: 2450BP15E0100E; Availability: Unavailable; Supplier 1: Digikey; Supplier Part Number 1: 712-2450BP15E0100001ECT-ND; Supplier 2: Farnell; Supplier Part Number 2: 2148528
L1 = CMP-06042-015013-1: Multilayer type Inductor for Automotive 6.2nH ±0.1nH 0.13Ω 700mA 0402
L2 = CMP-06042-011399-1: Multilayer type Inductor for Automotive 3.4nH ±0.1nH 0.09Ω 900mA 0402
L3 = CMP-06042-003843-1: Multilayer type RF Inductor 3.3nH ±0.3nH 0.12Ω 800mA 0402; DC Resistance (DCR): 190mR; Test Frequency: 100MHz; Core Material: Air; Current Rating: 300mA; Q Factor: 8; Self Resonant Frequency: 6GHz; Shielding: Unshielded; Termination: SMD/SMT; Case Code (Metric): 1005; Lead Free: Lead Free; Min Operating Temperature: -55°C; Radiation Hardening: No; Max Operating Temperature: 125°C; Mount: Surface Mount; Packaging: Tape and Reel; Length: 0.039inch; Case/Package: 0402; Depth: 0.55mm; Inductance: 3.3nH; REACH SVHC: No SVHC; Package Quantity: 10000; Current: 300mA; Height - Seated (Max): 0.022inch; Width: 0.02inch; DC Current: 300mA; Military Standard: Not; Max DC Current: 300mA; Case Code (Imperial): 0402; Height: 0.5mm
U1 = CMP-85923-000011-1: IC RF SWITCH SP3T 6GHZ 8MLP; Test Frequency: 5.9GHz; Number of Switches: 1; Turn-Off Delay Time: 20ns; IIP3: 50dBm; P1dB: 26dBm; Turn-On Delay Time: 55ns; Operating Frequency: 20 MHz to 6 GHz; Insertion Loss: 0.8dB; Impedance: 50R; Min Operating Temperature: -40°C; Max Operating Temperature: 100°C; Number of Pins: 8; Max Frequency: 6GHz; Mount: Surface Mount; Case/Package: QFN; Radiation Hardening: No; Frequency: 6GHz; Package Quantity: 3000; Throw Configuration: SP3T; RoHS Compliant: Yes; Series: -; Packaging: Tape and Reel; Technology: GAAS
Y1 = CM8V-T1A-32.768KHZ-7PF-20PPM-TA-QC: MF: {'manufacturer': u'Micro Crystal'}; Package: None; Price: None; Value: *; MP: CM8V-T1A-32.768KHZ-7PF-20PPM-TA-QC; Availability: Unavailable; Supplier 1: Arrow Electronics; Supplier Part Number 1: CM8V-T1A-32.768KHZ-7PF-20PPM-TA-QC

## Nets that join several sheets
GND: power_conversion (19 pins), power_core (15 pins), io_b (C28.2 C31.2 C43.2 U2.A15), rf_clocks (10 pins)
VIO: power_conversion (R12.1 R19.1 R21.2), power_core (5 pins), io_b (9 pins)

## Assembly variants
mcu_1v8_from_tinyprobe: not fitted C27 C39 C39 C40 C40 C53 C54 R12 R21 R23 R25 R28 R34 R35 U3
all_1v8: not fitted C27 C39 C39 C40 C40 C53 C54 R19 R21 R23 R25 R34 R35 R? U3